# Altium schematic sheet Page 02-BlockDiagram.SchDoc
size 416 x 264 mm; DocumentNumber: 2; SheetNumber: 2; PageSetup: Record=PageOptions|CenterHorizontal=True|CenterVertical=True|PrintScale=1.02|XCorrection=1.00|YCorrection=1.00|PrintKind=0|BorderSize=5000000|LeftOffset=0|BottomOffset=0|Orientation=2|PaperLength=1000|PaperWidth=1000|Scale=100|PaperSource=15|PrintQuality=600|MediaType=1|DitherType=10|PrintScaleMode=1|PaperKind=11x17|PaperIndex=17; Designer: Xuelu Li; DocumentFullPathAndName: //depot_np_hweng_boards/ung_hweng/UNG_8017_EVB-USB5926/
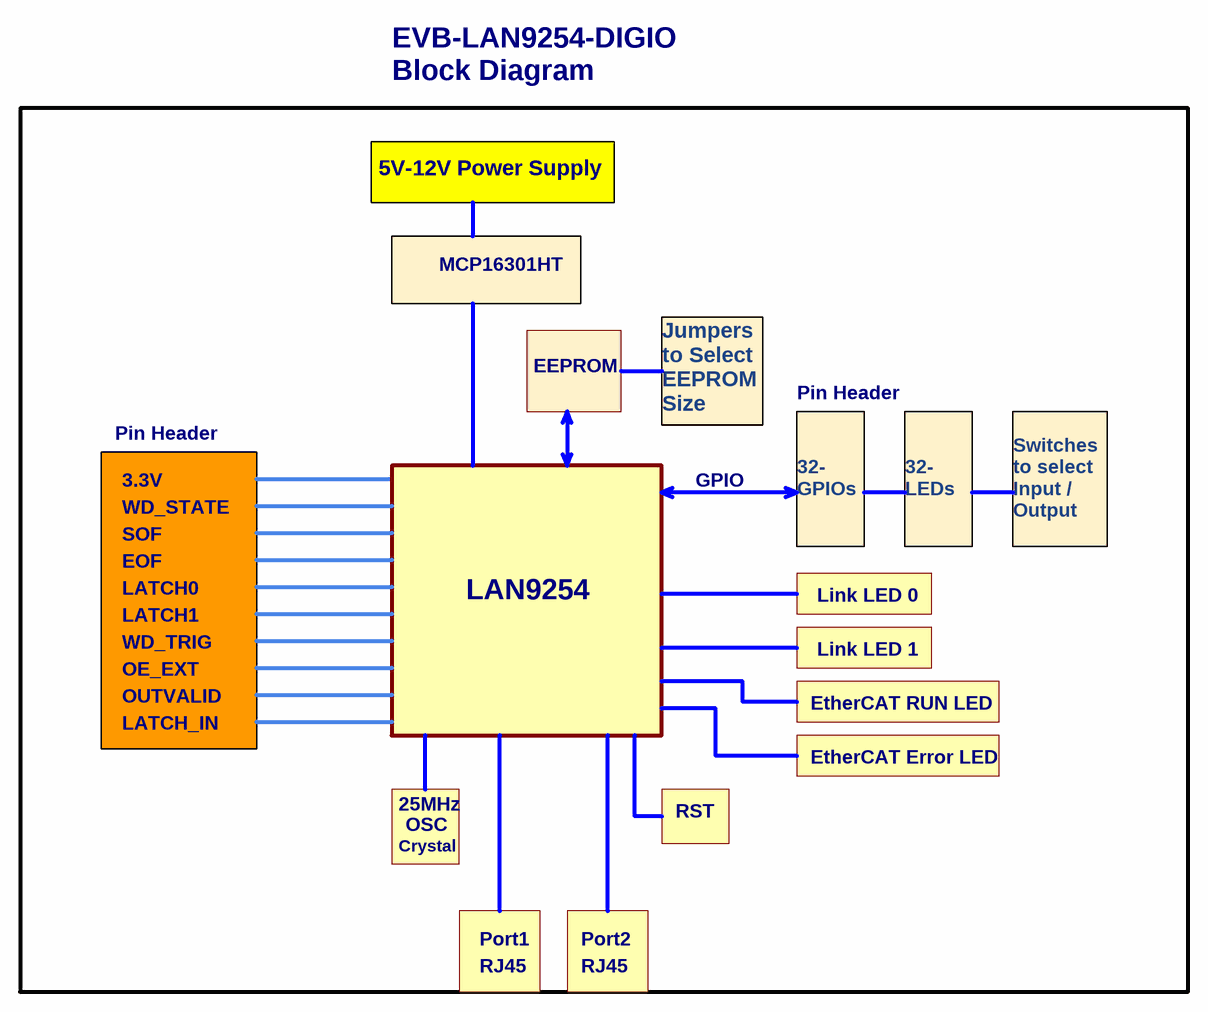
[diagram p0: Page 02-BlockDiagram.SchDoc]

## Parts
?  (no value)  (graphical)

## Notes on the sheet
- EVB-LAN9254-DIGIO
  Block Diagram
- 5V-12V Power Supply
- SOC EEPROM
- MCP16301HT
- Pin Header
- EEPROM
- Jumpers
  to Select
  EEPROM
  Size
- 3.3V
- GPIO
- WD_STATE
- SOF
- EOF
- 32-
  GPIOs
- 32-
  LEDs
- Switches
  to select
  Input /
  Output
- LATCH0
- LATCH1
- LAN9254
- Link LED 0
- WD_TRIG
- OE_EXT
- OUTVALID
- EtherCAT RUN LED
- Link LED 1
- LATCH_IN
- EtherCAT Error LED
- 25MHz
- OSC
- RST
- Crystal
- RJ45
- Port1
- Port2
- Microchip Technology, Inc.
  USB/Network Group - UNG
  www.Microchip.com
- Designed with
- Altium.com <http://go.altium.com/MicrochipLandingPage_Evaluation.html>
- Page Title:
- Project Name:
- Description:
- PN:
- Size:
- B
- Date:
- Designer:
- Sheet
- of
- Rev

## Library data of the parts
? = Title Block B_UNG1_Altium